# EAGLE schematic Shield_Motor_DIP (EAGLE 6.4)
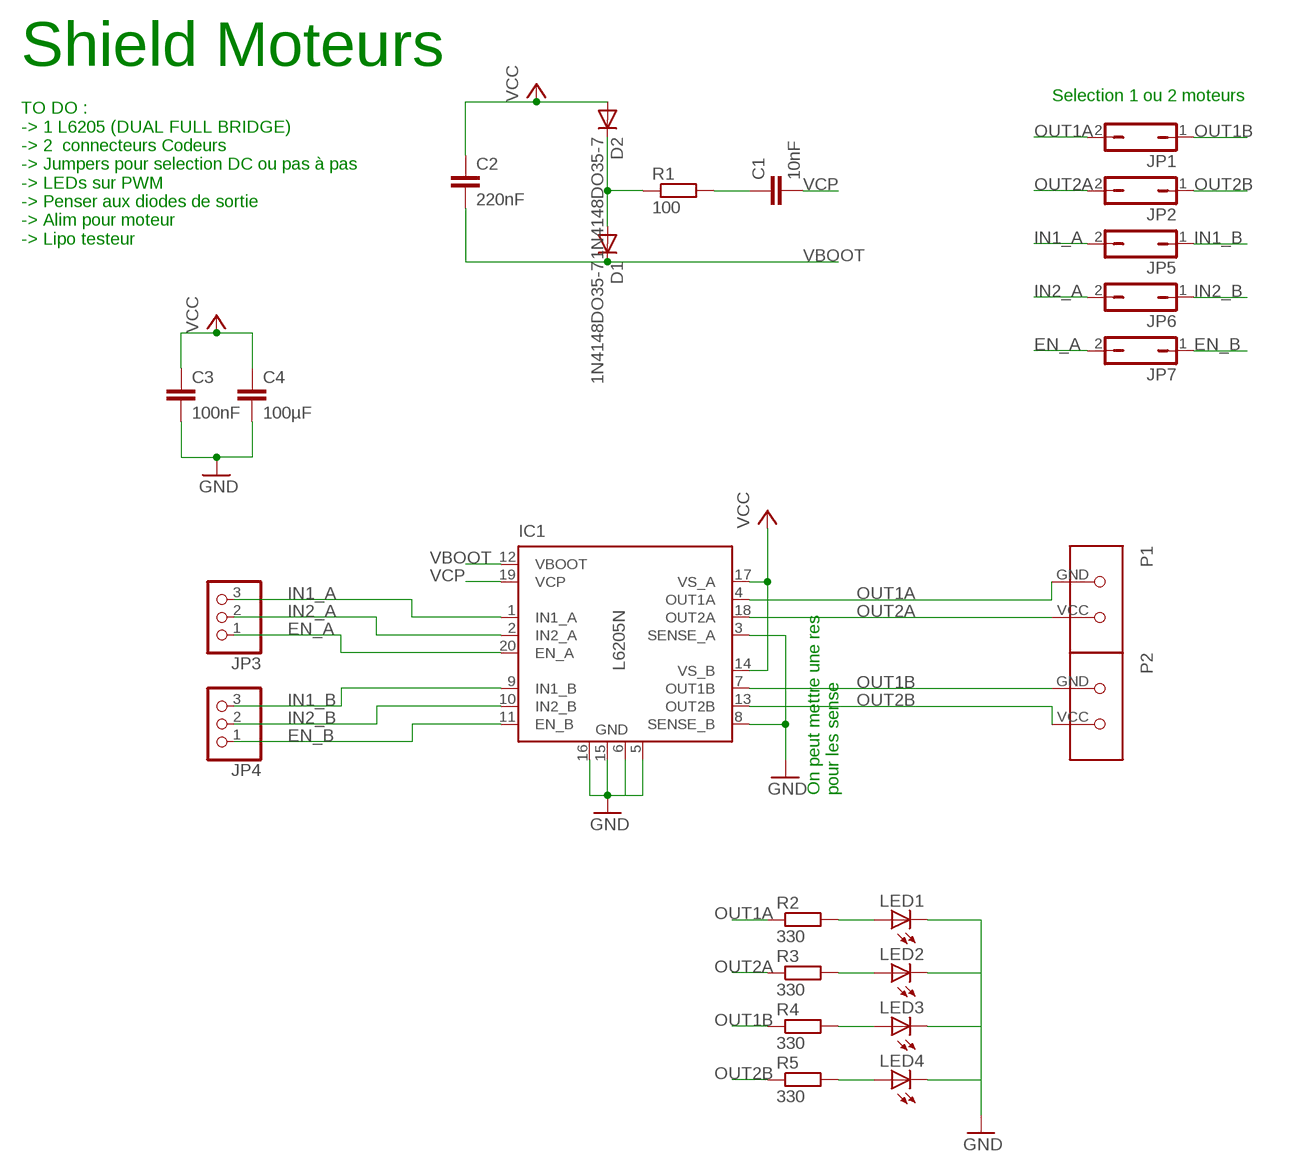
[diagram p0: schematic, sheet 1]

## Parts
C1  10nF  C-EU050-035X075  [C050-035X075]
C2  220nF  C-EU050-035X075  [C050-035X075]
C3  100nF  C-EU050-035X075  [C050-035X075]
C4  100µF  C-EU050-035X075  [C050-035X075]
D1  1N4148DO35-7  [DO35-7]
D2  1N4148DO35-7  [DO35-7]
IC1  L6205N  [DIL20]
JP1  JP1Q  [JP1]
JP2  JP1Q  [JP1]
JP3  PINHD-1X3  [1X03]
JP4  PINHD-1X3  [1X03]
JP5  JP1Q  [JP1]
JP6  JP1Q  [JP1]
JP7  JP1Q  [JP1]
LED1  LED3MM  [LED3MM]
LED2  LED3MM  [LED3MM]
LED3  LED3MM  [LED3MM]
LED4  LED3MM  [LED3MM]
P1  BORNIER_3.5MM  [BORNIER_COUDEE_3.5]
P2  BORNIER_3.5MM  [BORNIER_COUDEE_3.5]
R1  100  R-EU_0204/7  [0204/7]
R2  330  R-EU_0204/7  [0204/7]
R3  330  R-EU_0204/7  [0204/7]
R4  330  R-EU_0204/7  [0204/7]
R5  330  R-EU_0204/7  [0204/7]

## Nets
EN_A: IC1.20(EN_A) JP3.1 JP7.2
EN_B: IC1.11(EN_B) JP4.1 JP7.1
GND: C3.2 C4.2 IC1.3(SENSE_A) IC1.5(GND) IC1.6(GND) IC1.8(SENSE_B) IC1.15(GND) IC1.16(GND) LED1.K(C) LED2.K(C) LED3.K(C) LED4.K(C)
IN1_A: IC1.1(IN1_A) JP3.3 JP5.2
IN1_B: IC1.9(IN1_B) JP4.3 JP5.1
IN2_A: IC1.2(IN2_A) JP3.2 JP6.2
IN2_B: IC1.10(IN2_B) JP4.2 JP6.1
N$2: D1.A D2.C R1.1
N$3: C1.1 R1.2
N$4: LED1.A R2.2
N$7: LED2.A R3.2
N$9: LED3.A R4.2
N$11: LED4.A R5.2
OUT1A: IC1.4(OUT1A) JP1.2 P1.GND R2.1
OUT1B: IC1.7(OUT1B) JP1.1 P2.GND R4.1
OUT2A: IC1.18(OUT2A) JP2.2 P1.VCC R3.1
OUT2B: IC1.13(OUT2B) JP2.1 P2.VCC R5.1
VBOOT: C2.2 D1.C IC1.12(VBOOT)
VCC: C2.1 C3.1 C4.1 D2.A IC1.14(VS_B) IC1.17(VS_A)
VCP: C1.2 IC1.19(VCP)

## Notes on the sheet
- Shield Moteurs
- TO DO :
  -> 1 L6205 (DUAL FULL BRIDGE)
  -> 2  connecteurs Codeurs
  -> Jumpers pour selection DC ou pas à pas
  -> LEDs sur PWM
  -> Penser aux diodes de sortie
  -> Alim pour moteur
  -> Lipo testeur
- Selection 1 ou 2 moteurs
- On peut mettre une res
  pour les sense

## Library data of the parts
C1-C4 = rcl:C-EU: CAPACITOR, European symbol
D1 D2 = diode:1N4148: DIODE high speed (Philips)
IC1 = st-microelectronics:L6205: DUAL DMOS FULL BRIDGE MOTOR DRIVER; MF: Arrow Electronics; MPN: L6205N; OC_FARNELL: 1564367; OC_NEWARK: 89K0754
JP1 JP2 JP5-JP7 = jumper:JP1Q: JUMPER
JP3 JP4 = pinhead:PINHD-1X3: PIN HEADER
LED1-LED4 = led:LED: LED OSRAM: - CHIPLED LG R971, LG N971, LY N971, LG Q971, LY Q971, LO R971, LY R971 LH N974, LH R974 LS Q976, LO Q976, LY Q976 LO Q996 - Hyper CHIPLED LW Q18S LB Q993, LB Q99A, LB R99A - SideLED LS A670, LO A670, LY A670, LG A670, LP A670 LB A673, LV A673, LT A673, LW A673 LH A674 LY A675 LS A676, LA A676, LO A676, LY A676, LW A676 LS A679, LY A679, LG A679 - Hyper Micro SIDELED® LS Y876, LA Y876, LO Y876, LY Y876 LT Y87S - SmartLED LW L88C, LW L88S LB L89C, LB L89S, LG L890 LS L89K, LO L89K, LY L89K LS L896, LA L896, LO L896, LY L896 - TOPLED LS T670, LO T670, LY T670, LG T670, LP T670 LSG T670, LSP T670, LSY T670, LOP T670, LYG T670 LG T671, LOG T671, LSG T671 LB T673, LV T673, LT T673, LW T673 LH T674 LS T676, LA T676, LO T676, LY T676, LB T676, LH T676, LSB T676, LW T676 LB T67C, LV T67C, LT T67C, LS T67K, LO T67K, LY T67K, LW E67C LS E67B, LA E67B, LO E67B, LY E67B, LB E67C, LV E67C, LT E67C LW T67C LS T679, LY T679, LG T679 LS T770, LO T770, LY T770, LG T770, LP T770 LB T773, LV T773, LT T773, LW T773 LH T774 LS E675, LA E675, LY E675, LS T675 LS T776, LA T776, LO T776, LY T776, LB T776 LHGB T686 LT T68C, LB T68C - Hyper Mini TOPLED® LB M676 - Mini TOPLED Santana® LG M470 LS M47K, LO M47K, LY M47K Source: http://www.osram.convergy.de LUXEON: - LUMILED® LXK2-PW12-R00, LXK2-PW12-S00, LXK2-PW14-U00, LXK2-PW14-V00 LXK2-PM12-R00, LXK2-PM12-S00, LXK2-PM14-U00 LXK2-PE12-Q00, LXK2-PE12-R00, LXK2-PE12-S00, LXK2-PE14-T00, LXK2-PE14-U00 LXK2-PB12-K00, LXK2-PB12-L00, LXK2-PB12-M00, LXK2-PB14-N00, LXK2-PB14-P00, LXK2-PB14-Q00 LXK2-PR12-L00, LXK2-PR12-M00, LXK2-PR14-Q00, LXK2-PR14-R00 LXK2-PD12-Q00, LXK2-PD12-R00, LXK2-PD12-S00 LXK2-PH12-R00, LXK2-PH12-S00 LXK2-PL12-P00, LXK2-PL12-Q00, LXK2-PL12-R00 Source: www.luxeon.com KINGBRIGHT: KA-3528ASYC Source: www.kingbright.com
P1 P2 = Perso:BORNIER_3.5MM: Bornier 3.5mm Bornier emfichable 3.5mm coudée
R1-R5 = rcl:R-EU_: RESISTOR, European symbol